# EAGLE design WorkingVersion_Final_Bread_Proofing_Box_2020_06_04_Rev_B (EAGLE 9.6.1)

## Sheet 1 of 2
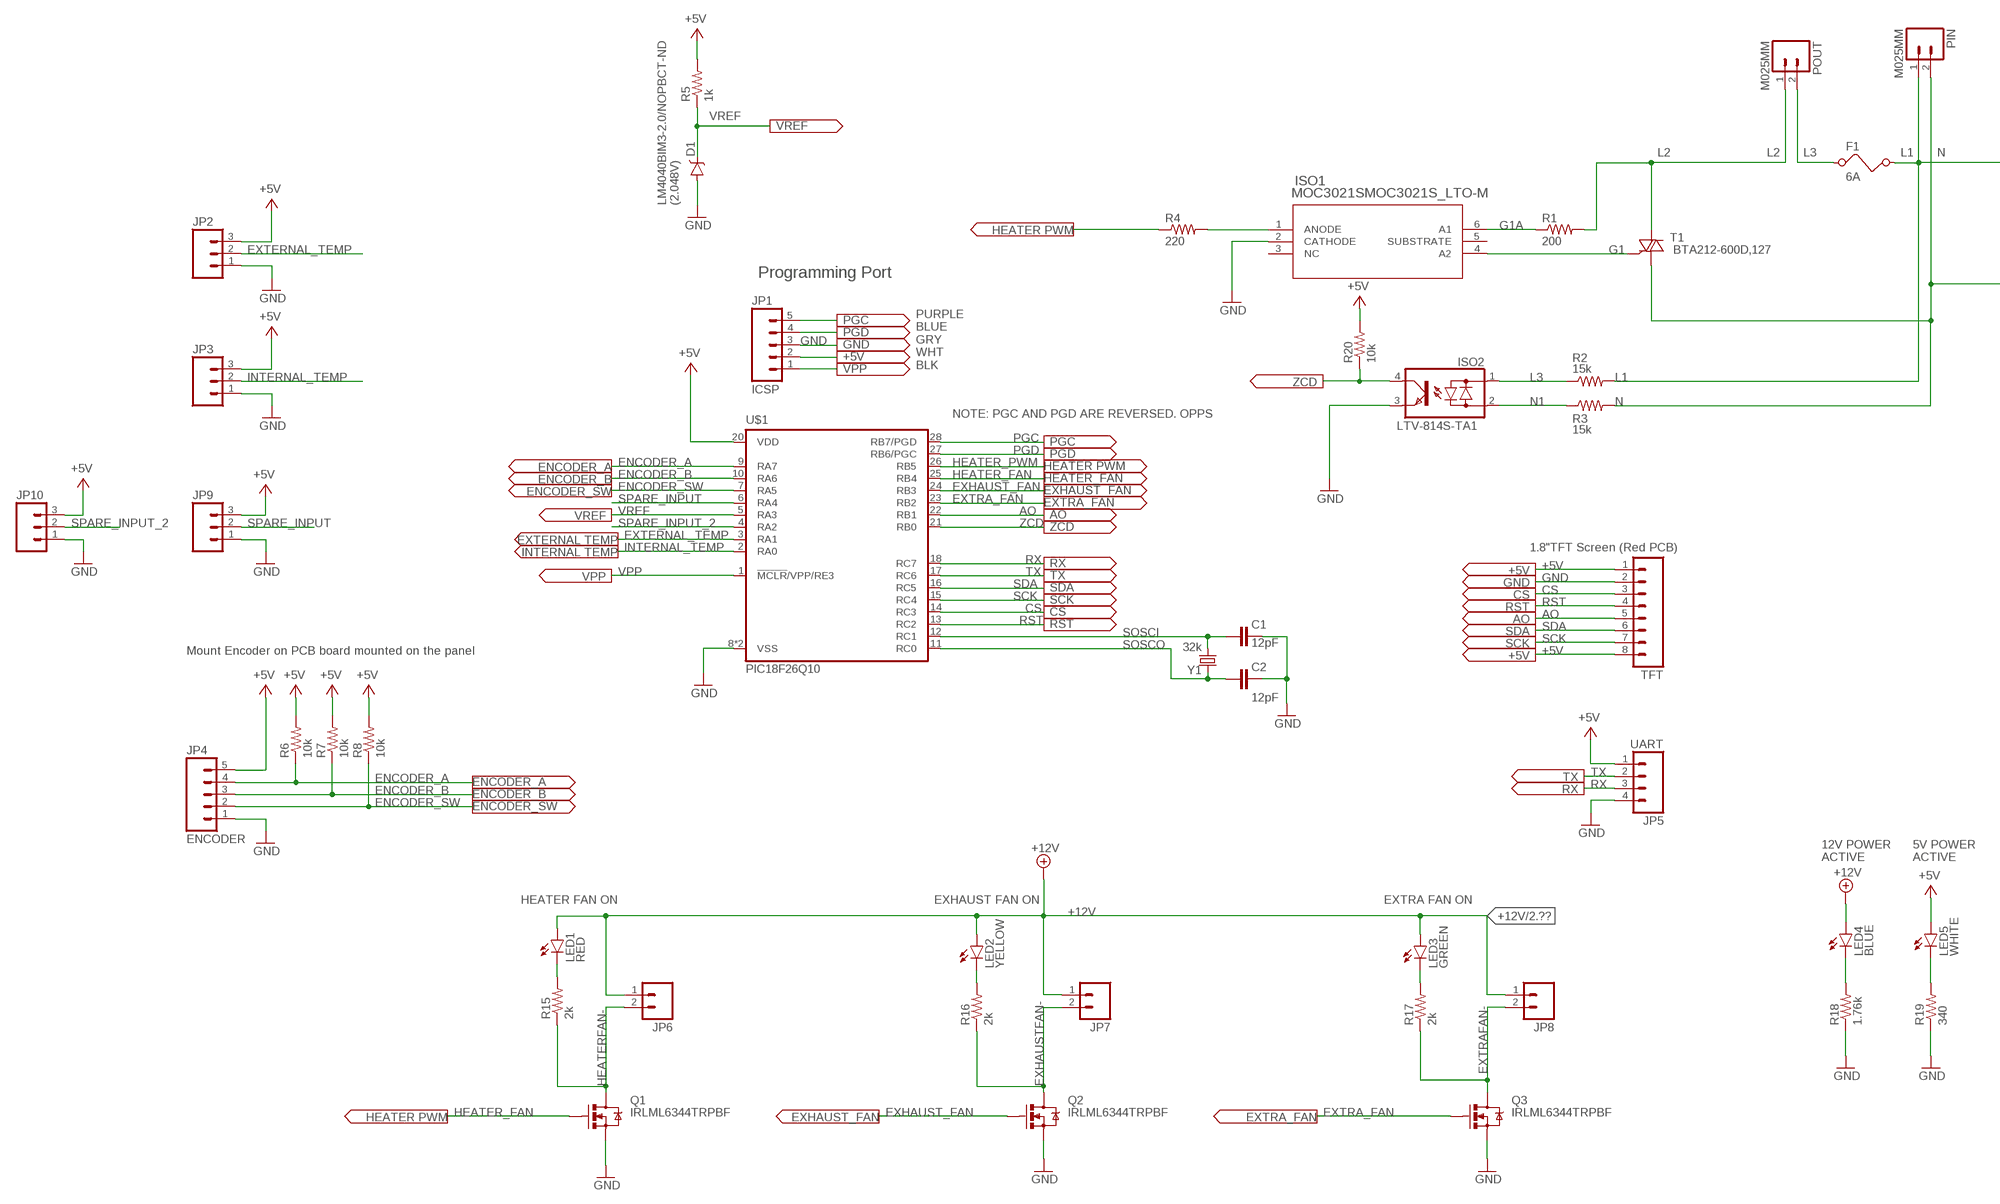
[diagram p0: schematic, sheet 1, part 1 of 2]
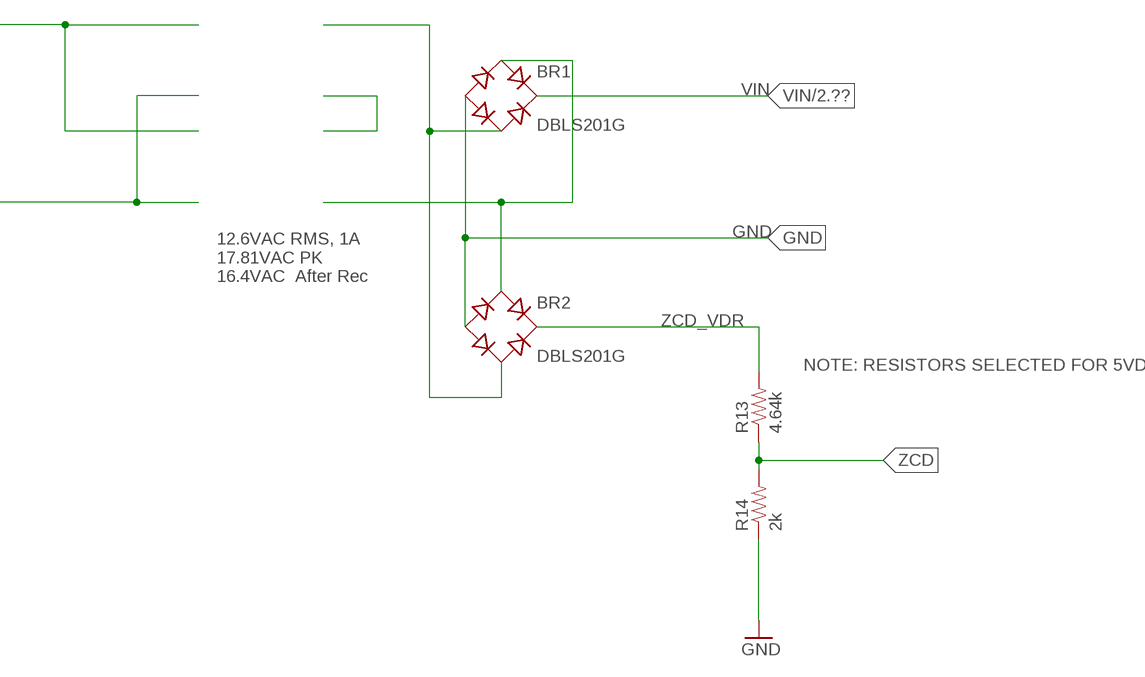
[diagram p1: schematic, sheet 1, part 2 of 2]

### Parts
BR1  DBLS201G  [DBS]
BR2  DBLS201G  [DBS]
C1  12pF  CAP0805  [0805]
C2  12pF  CAP0805  [0805]
D1  V-REFERENCESMD  [SOT23-3]
F1  6A  FUSE  [FUSE]
ISO1  MOC3021SMOC3021S_LTO-M  [MOC3021S_LTO-M]
ISO2  LTV-814S-TA1  SFH6206  [DIL4-SMD]
JP1  ICSP  M05PTH  [1X05]
JP2  M03POLAR  [MOLEX-1X3]
JP3  M03POLAR  [MOLEX-1X3]
JP4  ENCODER  M05PTH  [1X05]
JP5  UART  M04LOCK  [1X04_LOCK]
JP6  M02POLAR_LOCK  [MOLEX-1X2_LOCK]
JP7  M02POLAR_LOCK  [MOLEX-1X2_LOCK]
JP8  M02POLAR_LOCK  [MOLEX-1X2_LOCK]
JP9  M03POLAR  [MOLEX-1X3]
JP10  M03POLAR  [MOLEX-1X3]
LED1  RED  LED1206  [LED-1206]
LED2  YELLOW  LED1206  [LED-1206]
LED3  GREEN  LED1206  [LED-1206]
LED4  BLUE  LED1206  [LED-1206]
LED5  WHITE  LED1206  [LED-1206]
PIN  M025MM  [SCREWTERMINAL-5MM-2]
POUT  M025MM  [SCREWTERMINAL-5MM-2]
Q1  IRLML6344TRPBF  MOSFET-NCHANNEL2N7002PW  [SOT323]
Q2  IRLML6344TRPBF  MOSFET-NCHANNEL2N7002PW  [SOT323]
Q3  IRLML6344TRPBF  MOSFET-NCHANNEL2N7002PW  [SOT323]
R1  200  R-US_R2512  [R2512]
R2  15k  R-US_R2512  [R2512]
R3  15k  R-US_R2512  [R2512]
R4  220  RESISTOR1206  [1206]
R5  1k  RESISTOR1206  [1206]
R6  10k  RESISTOR1206  [1206]
R7  10k  RESISTOR1206  [1206]
R8  10k  RESISTOR1206  [1206]
R13  4.64k  RESISTOR1206  [1206]
R14  2k  RESISTOR1206  [1206]
R15  2k  RESISTOR1206  [1206]
R16  2k  RESISTOR1206  [1206]
R17  2k  RESISTOR1206  [1206]
R18  1.76k  RESISTOR1206  [1206]
R19  340  RESISTOR1206  [1206]
R20  10k  RESISTOR1206  [1206]
T1  BTA212-600D,127  BT138-V  [TO220BV]
TFT  M08LOCK  [1X08_LOCK]
U$1  PIC18F26Q10  PIC18F25K22SOIC  [SO28W]
Y1  32k  CRYSTALTC26V  [TC26V]

### Nets
+5V: JP1.2 JP2.3 JP3.3 JP4.5 JP5.1 JP9.3 JP10.3 LED5.A R5.2 R6.2 R7.2 R8.2 R20.2 TFT.1 TFT.8 U$1.20(VDD) ; also sheet 2
+12V: JP6.1 JP7.1 JP8.1 LED1.A LED2.A LED3.A LED4.A ; also sheet 2
AO: TFT.5 U$1.22(RB1)
CS: TFT.3 U$1.14(RC3)
ENCODER_A: JP4.4 R6.1 U$1.9(RA7)
ENCODER_B: JP4.3 R7.1 U$1.10(RA6)
ENCODER_SW: JP4.2 R8.1 U$1.7(RA5)
EXHAUST_FAN: Q2.1(G) U$1.24(RB3)
EXHAUSTFAN-: JP7.2 Q2.3(D) R16.1
EXTERNAL_TEMP: JP2.2 U$1.3(RA1)
EXTRA_FAN: Q3.1(G) U$1.23(RB2)
EXTRAFAN-: JP8.2 Q3.3(D) R17.1
G1: ISO1.4(A2) T1.G
G1A: ISO1.6(A1) R1.1
GND: BR1.- BR2.- C1.2 C2.2 D1.2(A) ISO1.2(CATHODE) ISO2.3(E) JP1.3 JP2.1 JP3.1 JP4.1 JP5.4 JP9.1 JP10.1 Q1.2(S) Q2.2(S) Q3.2(S) R14.1 R18.1 R19.1 TFT.2 U$1.8(VSS) U$1.19(VSS) ; also sheet 2
HEATER_FAN: Q1.1(G) U$1.25(RB4)
HEATER_PWM: R4.1 U$1.26(RB5)
HEATERFAN-: JP6.2 Q1.3(D) R15.1
INTERNAL_TEMP: JP3.2 U$1.2(RA0)
L1: F1.2 PIN.1 R2.2
L2: POUT.1 R1.2 T1.T2(A2)
L3: F1.1 ISO2.1(AC1) POUT.2 R2.1
N: PIN.2 R3.2 T1.T1(A1)
N1: ISO2.2(AC2) R3.1
N$1: ISO1.1(ANODE) R4.2
N$3: LED1.C R15.2
N$4: LED2.C R16.2
N$5: LED3.C R17.2
N$6: BR1.AC2 BR2.AC2
N$7: BR1.AC1 BR2.AC1
N$12: LED4.C R18.2
N$13: LED5.C R19.2
PGC: JP1.5 U$1.28(RB7/PGD)
PGD: JP1.4 U$1.27(RB6/PGC)
RST: TFT.4 U$1.13(RC2)
RX: JP5.3 U$1.18(RC7)
SCK: TFT.7 U$1.15(RC4)
SDA: TFT.6 U$1.16(RC5)
SOSCI: C1.1 U$1.12(RC1) Y1.1
SOSCO: C2.1 U$1.11(RC0) Y1.2
SPARE_INPUT: JP9.2 U$1.6(RA4)
SPARE_INPUT_2: JP10.2 U$1.4(RA2)
TX: JP5.2 U$1.17(RC6)
VIN: BR1.+ ; also sheet 2
VPP: JP1.1 U$1.1(!MCLR!/VPP/RE3)
VREF: D1.1(C) R5.1 U$1.5(RA3)
ZCD: ISO2.4(C) R13.1 R14.2 R20.1 U$1.21(RB0)
ZCD_VDR: BR2.+ R13.2
Unconnected: ISO1.3(NC) ISO1.5(SUBSTRATE)

### Notes on the sheet
- LM4040BIM3-2.0/NOPBCT-ND
  (2.048V)
- Programming Port
- 12.6VAC RMS, 1A
  17.81VAC PK
  16.4VAC  After Rec
- PURPLE
  BLUE
  GRY
  WHT
  BLK
- NOTE: RESISTORS SELECTED FOR 5VDC
- NOTE: PGC AND PGD ARE REVERSED. OPPS
- 1.8"TFT Screen (Red PCB)
- Mount Encoder on PCB board mounted on the panel
- 12V POWER
  ACTIVE
- 5V POWER
  ACTIVE
- HEATER FAN ON | EXHAUST FAN ON | EXTRA FAN ON

## Sheet 2 of 2
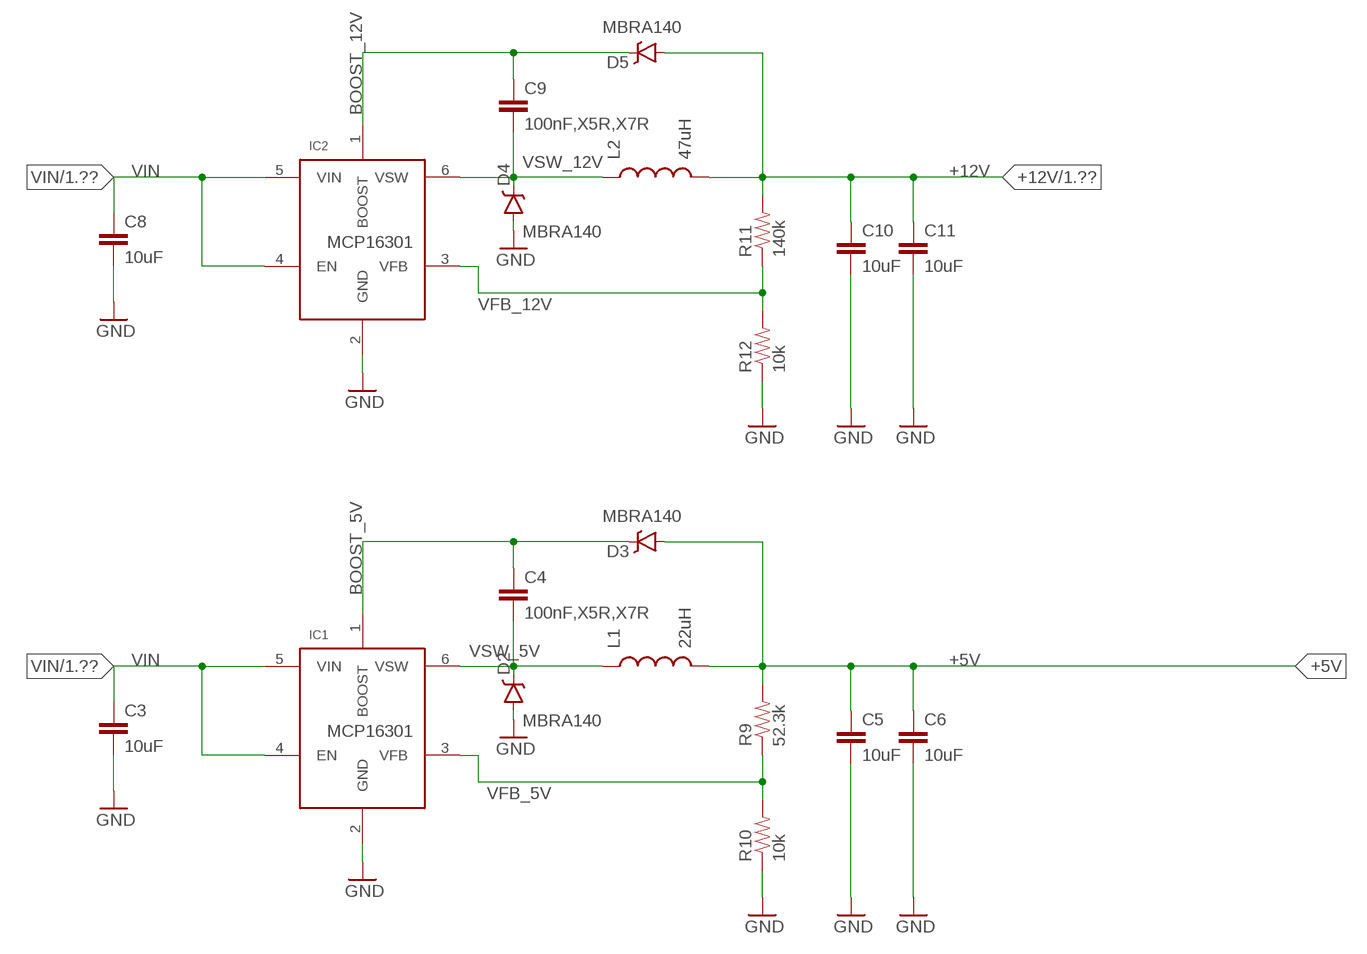
[diagram p2: schematic, sheet 2]

### Parts
C3  10uF  CAP1206  [1206]
C4  100nF,X5R,X7R  CAP1206  [1206]
C5  10uF  CAP1206  [1206]
C6  10uF  CAP1206  [1206]
C8  10uF  CAP1206  [1206]
C9  100nF,X5R,X7R  CAP1206  [1206]
C10  10uF  CAP1206  [1206]
C11  10uF  CAP1206  [1206]
D2  MBRA140  DIODE-SCHOTTKY-MBRA140  [SMA-DIODE]
D3  MBRA140  DIODE-SCHOTTKY-MBRA140  [SMA-DIODE]
D4  MBRA140  DIODE-SCHOTTKY-MBRA140  [SMA-DIODE]
D5  MBRA140  DIODE-SCHOTTKY-MBRA140  [SMA-DIODE]
IC1  MCP16301  [SOT23-6]
IC2  MCP16301  [SOT23-6]
L1  22uH  INDUCTOR1210  [1210]
L2  47uH  INDUCTOR1210  [1210]
R9  52.3k  RESISTOR1206  [1206]
R10  10k  RESISTOR1206  [1206]
R11  140k  RESISTOR1206  [1206]
R12  10k  RESISTOR1206  [1206]

### Nets
+5V: C5.1 C6.1 D3.A L1.2 R9.2 ; also sheet 1
+12V: C10.1 C11.1 D5.A L2.2 R11.2 ; also sheet 1
BOOST_5V: C4.1 D3.C IC1.1(BOOST)
BOOST_12V: C9.1 D5.C IC2.1(BOOST)
GND: C3.2 C5.2 C6.2 C8.2 C10.2 C11.2 D2.A D4.A IC1.2(GND) IC2.2(GND) R10.1 R12.1 ; also sheet 1
VFB_5V: IC1.3(VFB) R9.1 R10.2
VFB_12V: IC2.3(VFB) R11.1 R12.2
VIN: C3.1 C8.1 IC1.4(EN) IC1.5(VIN) IC2.4(EN) IC2.5(VIN) ; also sheet 1
VSW_5V: C4.2 D2.C IC1.6(VSW) L1.1
VSW_12V: C9.2 D4.C IC2.6(VSW) L2.1

### Notes on the sheet
- MCP16301
- MCP16301

## Library data of the parts
BR1 BR2 = rectifier:DB?*G: Single Phase 1.0 AMP Glass Passivated Bridge Rectifier Taiwan Semiconductor Co.,Ltd. - TSC Source: http://www.taiwansemi.com/TSCbig5/ezcatfiles/cust/img/img/db101g.pdf http://www.ts.com.tw/db/pictures/modules/PDT/PDT060207001/DBLS201G.pdf
C1-C6 C8-C11 = SparkFun-Capacitors:CAP: Capacitor Standard 0603 ceramic capacitor, and 0.1" leaded capacitor.
D1 = SparkFun-DiscreteSemi:V-REFERENCE: Zener diode
D2-D5 = SparkFun-DiscreteSemi:DIODE-SCHOTTKY: Schottky diodes in SFE's production catalog BAT20J 1A 23V 0.62Vf RB751 120mA 40V 0.37Vf PMEG4005EJ 0.5A 40V 0.42Vf MBRA140 1A 40V 0.5Vf B340A 3A 40V SMA; PROD_ID: DIO-08053
F1 = special:FUSE: FUSE 5 x 20 mm
IC1 IC2 = LM16301:MCP16301
ISO1 = MOC3021S:MOC3021S; BUILT_BY: EMA_Cory; COPYRIGHT: Copyright (C) 2018 Accelerated Designs. All rights reserved; MANUFACTURER_PART_NUMBER: MOC3021S; SOURCELIBRARY: Lite-On_2019-12-03; VENDOR: Lite-On
ISO2 = optocoupler:SFH620: Optocoupler, Phototransistor Output, AC Input Source: http://www.vishay.com/docs/83675/sfh620.pdf; MF: VISHAY/TELEFUNKEN; MPN: SFH6206-3; OC_FARNELL: 1469585; OC_NEWARK: 58K2214
JP1 JP4 = SparkFun-Connectors:M05: Header 5 Standard 5-pin 0.1" header. Use with straight break away headers (SKU : PRT-00116), right angle break away headers (PRT-00553), swiss pins (PRT-00743), machine pins (PRT-00117), and female headers (PRT-00115). Molex polarized connector foot print use with SKU : PRT-08230 with associated crimp pins and housings.
JP2 JP3 JP9 JP10 = SparkFun-Connectors:M03: Header 3 Standard 3-pin 0.1" header. Use with straight break away headers (SKU : PRT-00116), right angle break away headers (PRT-00553), swiss pins (PRT-00743), machine pins (PRT-00117), and female headers (PRT-00115). Molex polarized connector foot print use with SKU : PRT-08232 with associated crimp pins and housings.
JP5 = SparkFun-Connectors:M04: Header 4 Standard 4-pin 0.1" header. Use with straight break away headers (SKU : PRT-00116), right angle break away headers (PRT-00553), swiss pins (PRT-00743), machine pins (PRT-00117), and female headers (PRT-00115). Molex polarized connector foot print use with SKU : PRT-08231 with associated crimp pins and housings. 1MM SMD Version SKU: PRT-10208
JP6-JP8 = SparkFun-Connectors:M02: Standard 2-pin 0.1" header. Use with - straight break away headers ( PRT-00116) - right angle break away headers (PRT-00553) - swiss pins (PRT-00743) - machine pins (PRT-00117) - female headers (PRT-00115) Molex polarized connector foot print use with: PRT-08233 with associated crimp pins and housings. 2.54_SCREWTERM for use with PRT-10571. 3.5mm Screw Terminal footprints for PRT-08084 5mm Screw Terminal footprints for use with PRT-08432
L1 L2 = SparkFun-Passives:INDUCTOR: Inductors Basic Inductor/Choke - 0603 and 1206. Footprints are not proven and vary greatly between part numbers. SRN6045- 33uH, 20% 1.4A SDR0403-560KL - 56uH, 10%, 500mA RMS/740mA peak
LED1-LED5 = SparkFun-LED:LED: LEDs Standard schematic elements and footprints for 5mm, 3mm, 1206, and 0603 sized LEDs. 5mm - Spark Fun Electronics SKU : COM-00529 (and others)
PIN POUT = SparkFun-Connectors:M02: Standard 2-pin 0.1" header. Use with - straight break away headers ( PRT-00116) - right angle break away headers (PRT-00553) - swiss pins (PRT-00743) - machine pins (PRT-00117) - female headers (PRT-00115) Molex polarized connector foot print use with: PRT-08233 with associated crimp pins and housings. 2.54_SCREWTERM for use with PRT-10571. 3.5mm Screw Terminal footprints for PRT-08084 5mm Screw Terminal footprints for use with PRT-08432; STOREFRONT_ID: PRT-08432
Q1-Q3 = SparkFun-DiscreteSemi:MOSFET-NCHANNEL: Common NMOSFET Parts MFG P/N Store ID Prod ID FDD8780 TRANS-09984 SI7820DN TRANS-11055 FDS6630A IC-08089 2N7002PW TRANS-11151 FQP30N06L COM-10213 TRANS-10060 BSS123LT1G TRANS-08345 BSS138 TRANS-00830 BS170 2N7000; PROD_ID: TRANS-11151
R1-R3 = rcl:R-US_: RESISTOR, American symbol; SPICEPREFIX: R
R4-R20 = SparkFun-Resistors:RESISTOR: Resistor Basic schematic elements and footprints for 0603, 1206, and PTH resistors.
T1 = triac:BT138: TRIAC Source: http://www.semiconductors.philips.com BT138_SERIES_2.pdf
TFT = SparkFun-Connectors:M08: Header 8 Standard 8-pin 0.1" header. Use with straight break away headers (SKU : PRT-00116), right angle break away headers (PRT-00553), swiss pins (PRT-00743), machine pins (PRT-00117), and female headers (PRT-00115).
U$1 = PIC18F25K22:PIC18F25K22
Y1 = adafruit:CRYSTAL: CRYSTAL; OC_FARNELL: unknown; OC_NEWARK: unknown

## Board
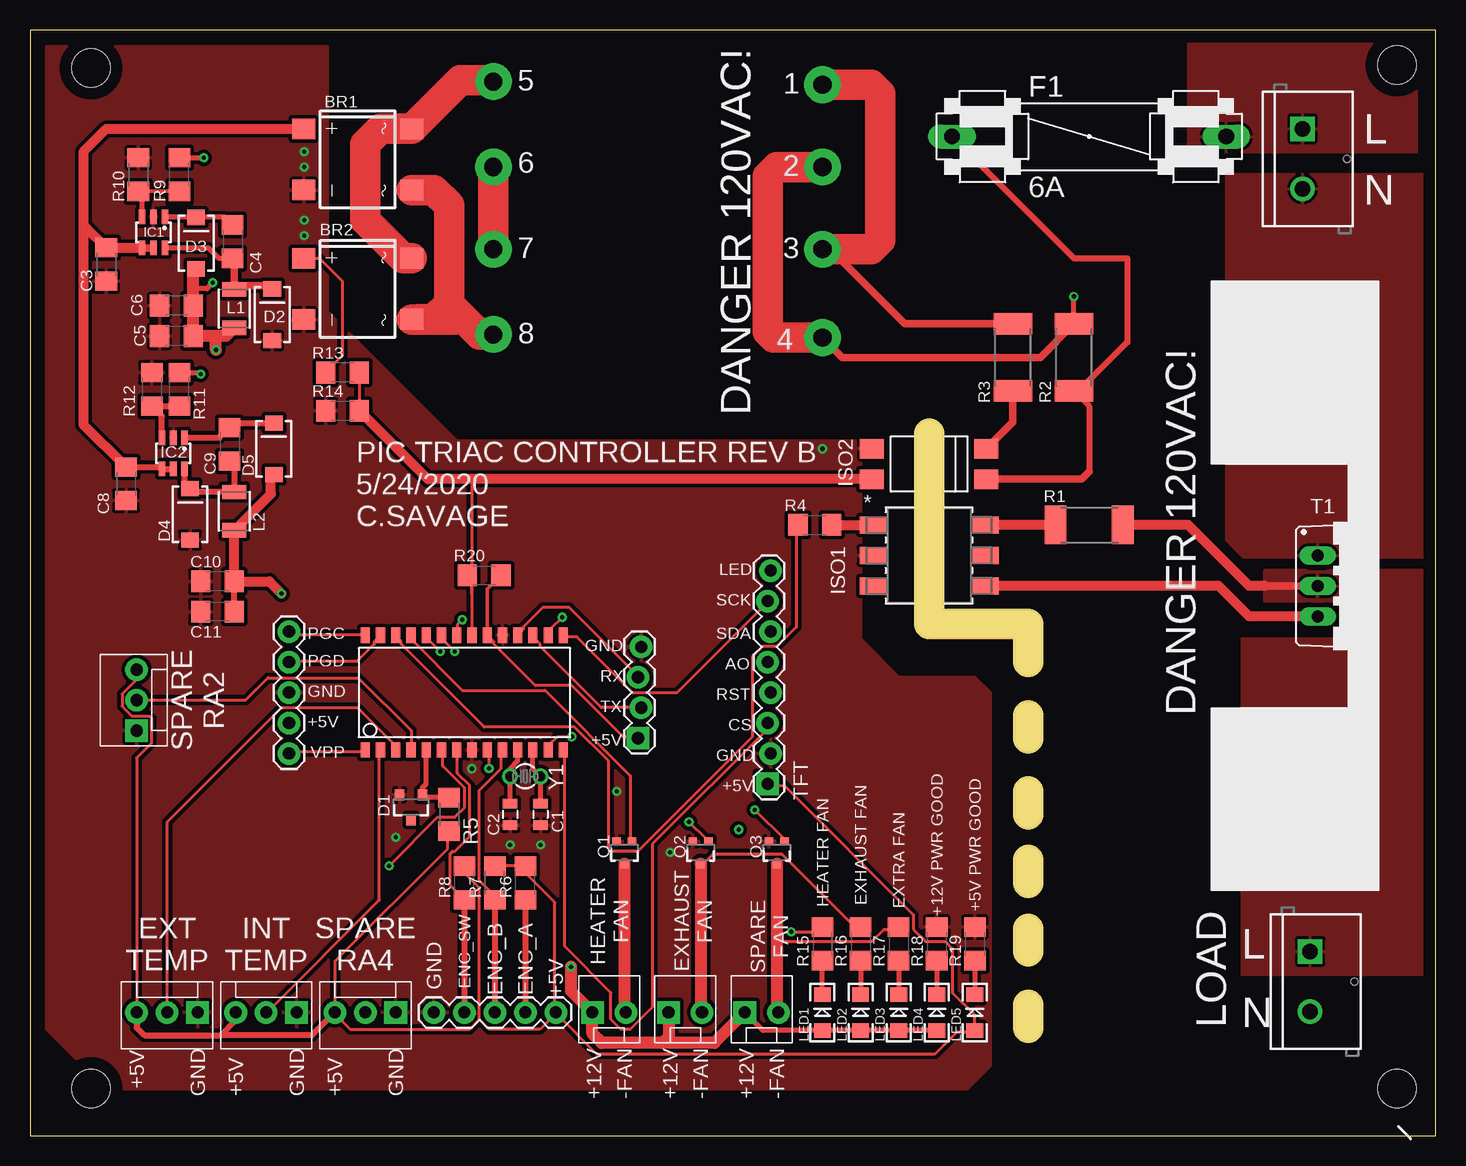
[diagram p3: board, top side]
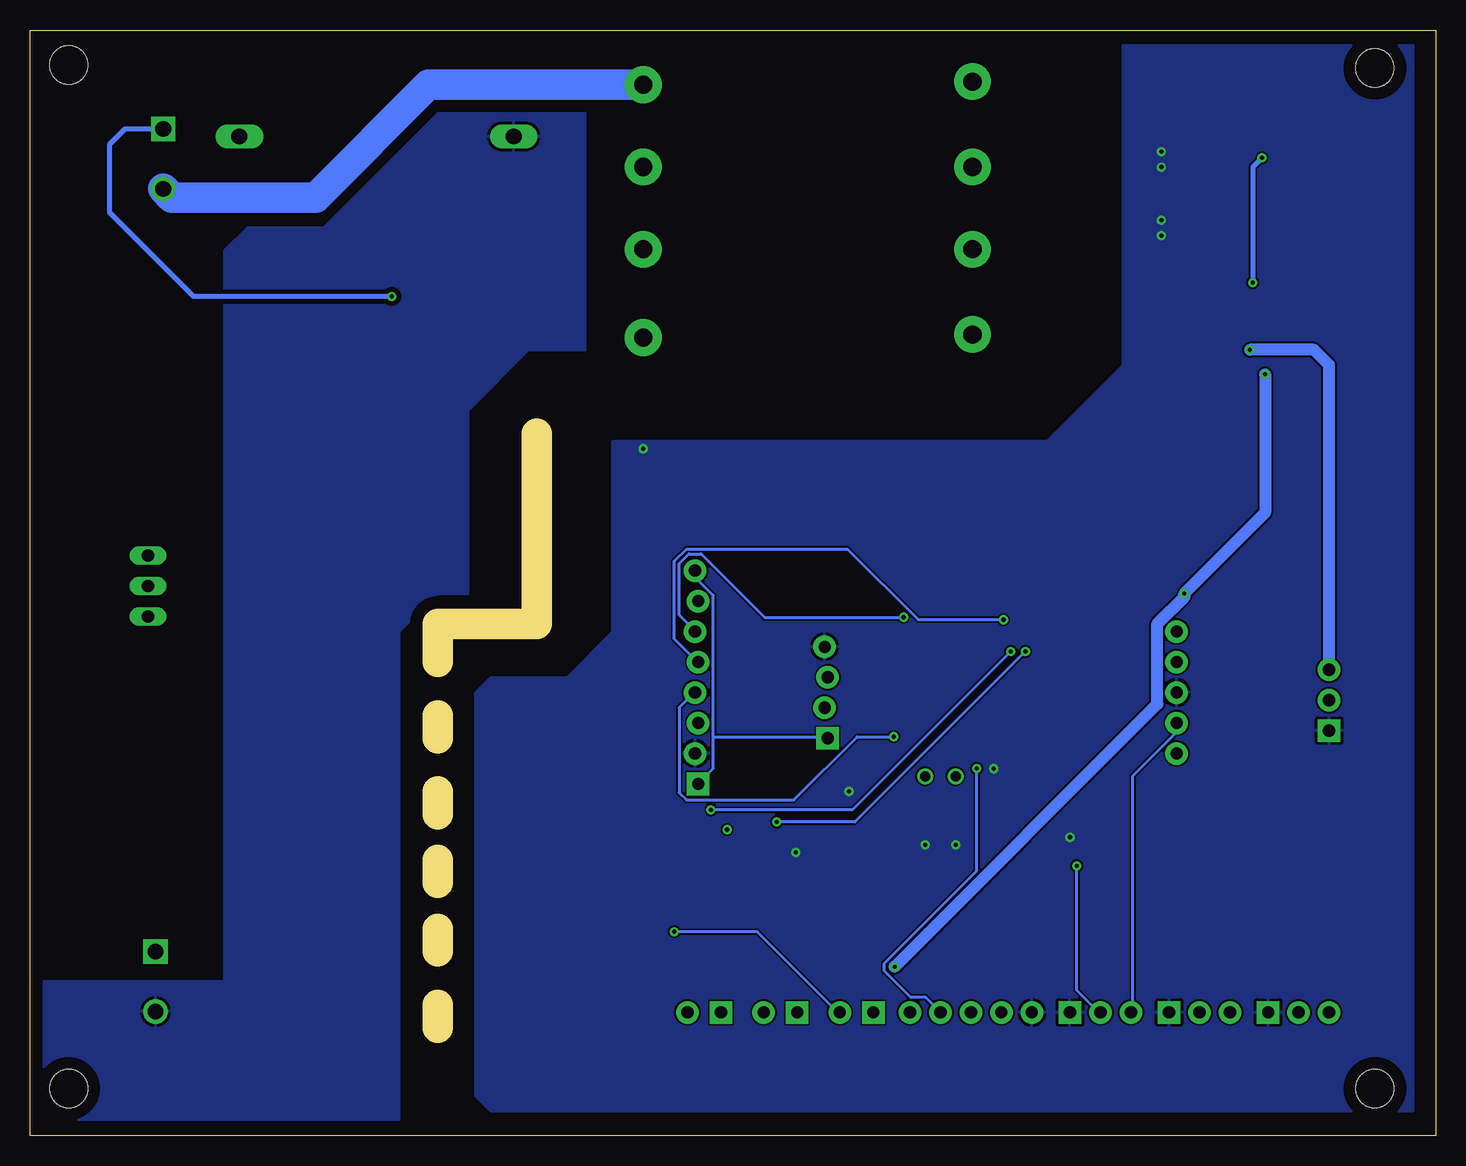
[diagram p4: board, bottom side, seen from below]

Size 117.14 x 92.19 mm. Coordinates in mm from the lower left corner, seen from the top.
Outline: 74.93,58.55 74.93,42.67 83.18,42.67 83.18,39.5
Outline: 83.18,35.05 83.18,33.15
Outline: 83.18,28.7 83.18,26.8
Outline: 83.18,22.99 83.18,21.08
Outline: 83.18,17.27 83.18,15.37
Outline: 83.18,10.92 83.18,9.02
Outline: 0,0 117.14,0 117.14,92.19 0,92.19 0,0
Copper layers (1*16): Top 0.035mm / dielectric 1.5mm / Bottom 0.035mm
Design rules "default": minimum track width 10mil, minimum drill 0.35mm, track to track 6mil, track to pad 6mil, pad to pad 6mil, via to via 6mil, smd to smd 6mil, copper to edge 40mil, drill to drill 6mil, minimum pad ring 10mil, minimum via ring 8mil, stop-mask expansion 4mil, vias tented up to drill 0mil, thermal gap 10mil
Holes 3.17 mm at 5.08,3.94 113.92,3.94 113.92,89.28 5.08,89.03
tKeepout: area 72.4,4.6 to 85.1,62.4
Milling: 10 lines

### Footprints (pad centres in the part's own frame; a part is rotated, then mirrored left to right if it is on the bottom)
DBS = smd 1.7 x 1.9: + -2.55,-4.5; - 2.55,-4.5; AC1 -2.55,4.5; AC2 2.55,4.5
0805 = smd 0.8 x 1.2: 1 -0.9,0; 2 0.9,0
1206 = smd 1.6 x 1.8: 1 -1.4,0; 2 1.4,0
SOT23-3 = smd 0.8 x 0.9: 1 -0.95,-1; 2 0.95,-1; 3 0,1.1
SMA-DIODE = smd 1.27 x 1.47: A -2.15,0; C 2.15,0
FUSE = drill 1.321 long: 1 -11.43,0; 2 11.43,0
SOT23-6 = smd 0.55 x 1.2: 1 0.95,1.3; 2 0,1.3; 3 -0.95,1.3; 4 -0.95,-1.3; 5 0,-1.3; 6 0.95,-1.3
MOC3021S_LTO-M = smd 2.261 x 1.397: 1 -4.661,2.54; 2 -4.661,0; 3 -4.661,-2.54; 4 4.661,-2.54; 5 4.661,0; 6 4.661,2.54
DIL4-SMD = smd 1.6 x 2: 1 -1.27,-4.77; 2 1.27,-4.77; 3 1.27,4.77; 4 -1.27,4.77
1X05 = drill 1.016 pad 1.88: 1 0,0; 2 2.54,0; 3 5.08,0; 4 7.62,0; 5 10.16,0
MOLEX-1X3 = drill 1.016 pad 1.88 square: 1 0,0 | drill 1.016 pad 1.88: 2 2.54,0; 3 5.08,0
1X04_LOCK = drill 1.016 pad 1.88 square: 1 0,0.127 | drill 1.016 pad 1.88: 2 2.54,-0.127; 3 5.08,0.127; 4 7.62,-0.127
MOLEX-1X2_LOCK = drill 1.016 pad 1.88 square: 1 -0.127,0 | drill 1.016 pad 1.88: 2 2.667,0
1210 = smd 1.2 x 2: 1 -1.6,0; 2 1.6,0
LED-1206 = smd 1.2 x 1.4: A -1.5,0; C 1.5,0
SCREWTERMINAL-5MM-2 = drill 1.3 pad 2.032 square: 1 0,0 | drill 1.3 pad 2.032: 2 5,0
SOT323 = smd 0.7 x 0.7: 1 -0.65,-0.925; 2 0.65,-0.925; 3 0,0.925
R2512 = smd 1.8 x 3.2: 1 -2.8,0; 2 2.8,0
TO220BV = drill 1.016 long: G 2.54,-2.54; T1 -2.54,-2.54; T2 0,-2.54
1X08_LOCK = drill 1.016 pad 1.88 square: 1 0,0.127 | drill 1.016 pad 1.88: 2 2.54,-0.127; 3 5.08,0.127; 4 7.62,-0.127; 5 10.16,0.127; 6 12.7,-0.127; 7 15.24,0.127; 8 17.78,-0.127
SO28W = smd 0.762 x 1.27: 1 -7.62,-4.78; 2 -6.35,-4.78; 3 -5.08,-4.78; 4 -3.81,-4.78; 5 -2.54,-4.78; 6 -1.27,-4.78; 7 0,-4.78; 8 1.27,-4.78; 9 2.54,-4.78; 10 3.81,-4.78; 11 5.08,-4.78; 12 6.35,-4.78; 13 7.62,-4.78; 14 8.89,-4.78; 15 8.89,4.78; 16 7.62,4.78; 17 6.35,4.78; 18 5.08,4.78; 19 3.81,4.78; 20 2.54,4.78; 21 1.27,4.78; 22 0,4.78; 23 -1.27,4.78; 24 -2.54,4.78; 25 -3.81,4.78; 26 -5.08,4.78; 27 -6.35,4.78; 28 -7.62,4.78
TC26V = drill 0.813: 1 -1.27,0; 2 1.27,0

### Placement (x,y rotation side)
BR1  27.3,81.41 270 top
BR2  27.3,70.61 270 top
C1  42.55,26.8 270 top
C2  40.01,26.8 270 top
C3  6.35,72.64 270 top
C4  16.89,74.55 270 top
C5  12.19,66.67 180 top
C6  12.19,69.22 180 top
C8  8,54.36 270 top
C9  16.64,57.66 270 top
C10  15.62,46.23 180 top
C11  15.62,43.69 180 top
D1  31.75,27.43 180 top
D2  20.19,68.45 90 top
D3  13.84,74.42 90 top
D4  13.34,51.82 90 top
D5  20.32,57.28 90 top
F1  88.27,83.31 0 top
HEATSINK  [7-345-2PP-BA]  112.39,45.85 90 top
IC1  10.29,75.31 0 top
IC2  11.94,56.9 0 top
ISO1  74.93,48.39 0 top
ISO2  74.93,56.01 90 top
JP1  21.59,31.88 90 top
JP2  13.97,10.29 180 top
JP3  22.23,10.29 180 top
JP4  33.66,10.29 0 top
JP5  50.8,33.15 90 top
JP6  46.99,10.29 0 top
JP7  53.34,10.29 0 top
JP8  59.69,10.29 0 top
JP9  30.48,10.29 180 top
JP10  8.89,33.78 90 top
L1  17.02,68.96 270 top
L2  17.02,52.07 270 top
LED1  66.04,10.29 90 top
LED2  69.22,10.29 90 top
LED3  72.39,10.29 90 top
LED4  75.56,10.29 90 top
LED5  78.74,10.29 90 top
PIN  106.04,83.95 270 top
POUT  106.68,15.37 270 top
Q1  49.53,23.62 180 top
Q2  55.88,23.62 180 top
Q3  62.23,23.62 180 top
R1  88.27,50.93 0 top
R2  86.99,64.9 90 top
R3  81.91,64.9 90 top
R4  65.41,50.93 0 top
R5  34.92,26.8 270 top
R6  41.27,21.08 90 top
R7  38.73,21.08 90 top
R8  36.2,21.08 90 top
R9  12.45,80.14 90 top
R10  9.02,80.14 270 top
R11  12.45,62.23 90 top
R12  10.16,62.23 270 top
R13  26.03,63.63 180 top
R14  26.03,60.45 0 top
R15  66.04,16 270 top
R16  69.22,16 270 top
R17  72.39,16 270 top
R18  75.56,16 270 top
R19  78.74,16 270 top
R20  37.85,46.74 0 top
T1  109.85,45.85 270 top
TFT  61.59,29.34 90 top
U$1  35.56,36.96 0 top
Y1  41.27,29.97 180 top

### Tracks (layer width: path | path; a pad name or v marks a point on that pad's centre or on a via)
+5V  (via drill 0.35)
  Top 0.254: U$1.20 38.25,41.6 38.66,41.2 38.66,41 42.11,37.54 45.16,37.54 49.43,33.27 50.65,33.27 JP5.1 | TFT.1 61.62,29.21 62.84,29.21 73.61,18.44 73.61,17.22 74.62,16.2 76.25,16.2 76.86,15.6 76.86,11.94 78.69,10.11 78.69,8.89 LED5.A 78.69,8.69 77.27,8.69 75.44,6.86 47.19,6.86 43.94,10.11 JP4.5 | R7.2 38.86,22.5 41.1,22.5 R6.2 41.3,22.3 41.3,21.89 43.74,19.46 43.74,10.31 JP4.5 | 37.44,9.7 37.44,20.68 36.22,21.89 36.22,22.3 R8.2 | 37.44,9.7 38.25,8.89 42.52,8.89 43.74,10.11 JP4.5 | R5.2 34.8,25.35 34.8,23.93 25.45,14.58 25.45,10.52 JP9.3 25.45,10.11 26.67,8.89 36.63,8.89 37.44,9.7 | JP10.3 8.89,38.05 7.67,36.83 7.67,35.82 8.49,35 9.95,35 10.11,34.84 10.11,32.73 8.89,31.51 JP2.3
  Top 0.305: U$1.20 38.1,45.59 R20.2
  Top 0.406: R9.2 v14.47,81.54 v14.48,81.53 | v15.24,71.12 14.73,70.61 13.59,70.61
  Top 0.508: JP2.3 8.89,9.02 9.52,8.38 15.88,8.38 | 15.88,8.38 17.14,9.65 JP3.3 | JP9.3 23.49,8.38 15.88,8.38
  Top 1.016: D3.A 13.59,72.02 13.59,70.61 C6.1 C5.1 15.49,66.67 | L1.2 16.33,66.67 15.49,66.67 | v15.49,65.53 15.49,66.67
  Bottom 0.254: 60.2,33.27 60.2,30.63 61.42,29.41 TFT.1 | 60.2,33.27 60.2,45.06 61.62,46.48 61.62,47.09 TFT.8 | 60.2,33.27 50.85,33.27 JP5.1 | JP9.3 25.25,10.31 25.25,30.02 21.59,33.68 JP1.2 21.59,34.49
  Bottom 0.406: v14.48,81.53 15.24,80.77 v15.24,71.12
  Bottom 1.016: JP10.3 8.89,64.26 10.16,65.53 v15.49,65.53
+12V  (via drill 0.35)
  Top 0.406: LED4.A LED3.A LED2.A LED1.A 61.06,8.79 JP8.1 | R11.2 14.09,63.63 v14.22,63.5
  Top 0.508: 20.07,54.86 20.32,55.12 D5.A | C11.1 C10.1
  Top 0.813: v20.95,45.21 19.94,46.23 C10.1 L2.2 20.07,53.52 20.07,54.86
  Top 1.016: JP8.1 57.02,7.75 52.7,7.75 | 52.7,7.75 47.62,7.75 46.86,8.51 JP6.1 45.09,12.06 v45.09,14.1 | JP7.1 53.21,8.25 52.7,7.75
  Bottom 0.406: v14.22,63.5 14.3,63.42
  Bottom 1.016: v45.09,14.1 23.19,35.99 23.19,42.7 20.95,44.94 v20.95,45.21 14.22,51.94 v14.22,63.5
AO  (via drill 0.35)
  Top 0.254: v36.02,43.03 35.61,42.62 35.61,41.81 U$1.22
  Bottom 0.254: v36.02,43.03 43.13,43.03 49.02,48.92 62.43,48.92 63.45,47.9 63.45,41.4 61.62,39.57 TFT.5
BOOST_5V
  Top 0.406: C4.1 16.27,76.57 D3.C 11.28,76.57 IC1.1
BOOST_12V
  Top 0.508: D5.C 17.01,59.43 C9.1 15.78,58.2 IC2.1
CS
  Top 0.254: U$1.14 44.55,32.05 44.55,15.8 48.41,11.94 48.41,9.7 49.23,8.89 50.04,8.89 51.87,10.72 51.87,24.33 61.42,33.88 61.42,34.29 TFT.3
ENCODER_A  (via drill 0.35)
  Top 0.254: v38.25,30.63 38.25,32.05 U$1.9
  Top 0.508: R6.1 JP4.4
  Bottom 0.254: v38.25,30.63 38.25,22.1 45.97,14.38 45.97,13.77 43.74,11.53 42.52,11.53 JP4.4
ENCODER_B
  Top 0.254: U$1.10 39.27,32.05 39.27,30.63 37.44,28.8 37.44,21.29 38.86,19.86 R7.1
  Top 0.508: R7.1 JP4.3
ENCODER_SW
  Top 0.254: U$1.7 35.61,32.05 35.61,30.23 36.63,29.21 36.63,24.94 35.41,23.72 35.2,23.72 35,23.52 35,20.88 36.02,19.86 R8.1
  Top 0.508: R8.1 JP4.2
EXHAUST_FAN  (via drill 0.35)
  Top 0.254: v54.91,26.16 56.34,24.74 Q2.1 | v34.19,40.39 32.97,41.6 U$1.24
  Bottom 0.254: v54.91,26.16 48.41,26.16 v34.19,40.39
EXHAUSTFAN-
  Top 0.254: R16.1 69.14,17.42 68.73,17.42 62.64,23.52 56.95,23.52 56.34,22.91 Q2.3
  Top 1.016: Q2.3 55.88,10.41 JP7.2
EXTERNAL_TEMP
  Top 0.254: JP2.2 11.43,26.16 20.98,35.71 27.28,35.71 30.33,32.66 30.33,32.26 U$1.3
EXTRA_FAN  (via drill 0.35)
  Top 0.254: v60.4,27.18 62.84,24.74 Q3.1 | v35.41,40.39 34.19,41.6 U$1.23
  Bottom 0.254: v60.4,27.18 48.62,27.18 v35.41,40.39
EXTRAFAN-
  Top 0.254: 62.23,16.2 70.16,16.2 71.17,17.22 72.39,17.22 R17.1
  Top 1.016: Q3.3 62.23,16.2 62.23,10.41 JP8.2
G1
  Top 0.61: 80.01,45.85 ISO1.4
  Top 0.813: T1.G 101.6,43.31 99.06,45.85 80.01,45.85
G1A
  Top 0.61: 80.01,50.93 ISO1.6
  Top 0.813: R1.1 80.01,50.93
GND  (via drill 0.35)
  other vias: 40.01,24.26 42.55,24.26 36.83,30.61 30.48,24.89 22.86,82.04 22.86,80.77 22.86,76.33 22.86,75.06 48.9,28.7 53.34,23.62 66.04,57.28
  pour Top (isolate 0.305, rank 2): 1.4,90.8 1.4,8.89 6.35,3.94 78.1,3.94 80.01,5.84 80.01,36.96 78.74,38.23 72.39,38.23 69.22,41.4 69.22,57.91 35.56,57.91 24.77,68.71 24.77,90.8
  pour Bottom: 6.35,2.03 75.56,2.03 78.74,2.03 80.01,3.3 80.01,36.96 78.74,38.23 72.39,38.23 68.58,42.04 68.58,57.91 32.38,57.91 31.75,58.55 26.03,64.26 26.03,90.93 1.9,90.93 1.9,2.03
HEATER_FAN
  Top 0.254: U$1.25 31.75,41.4 36.02,37.13 42.93,37.13 50.04,30.02 50.04,24.74 Q1.1
HEATER_PWM
  Top 0.254: U$1.26 30.53,41.6 30.94,41.2 30.94,41 37.85,34.09 45.36,34.09 48.21,31.24 48.21,23.93 48.41,23.72 50.65,23.72 60.2,33.27 60.2,39.98 61.01,40.79 62.23,40.79 63.86,42.42 63.86,50.75 R4.1
HEATERFAN-  (via drill 0.35)
  Top 0.254: v63.45,17.02 65.48,17.02 R15.1
  Top 1.016: Q1.3 49.53,10.41 JP6.2
  Bottom 0.254: v63.45,17.02 56.54,17.02 49.84,10.31 JP6.2
INTERNAL_TEMP
  Top 0.254: U$1.2 29.11,32.05 29.11,19.66 19.76,10.31 JP3.2
L1  (via drill 0.35, 1.52 pad 3.05)
  Top 0.406: R2.2 v86.99,69.98
  Top 0.61: R2.2 84.19,64.9 67.69,64.9 v66.04,66.55
  Top 2.54: v66.04,80.77 62.23,80.77 61.47,80.01 61.47,67.06 61.98,66.55 v66.04,66.55
  Bottom 0.406: v86.99,69.98 103.5,69.98 110.49,76.96 110.49,82.68 109.22,83.95 PIN.1
  pour Top (isolate 0.406): 96.52,82.04 115.57,82.04 115.57,91.57 96.52,91.57
L2
  Top 0.61: T1.T2 102.87,45.85
  Top 0.813: 102.87,45.85 101.6,45.85 96.52,50.93 R1.2
  pour Top (isolate 0.406): 116.2,47.12 102.87,47.12 102.87,44.58 109.85,44.58 109.85,41.4 100.96,41.4 100.96,13.46 116.2,13.46
L3
  Top 0.508: F1.1 86.99,73.15 91.44,73.15 91.44,66.17 86.99,61.72 | R2.1 88.27,60.83 88.27,55.37
  Top 0.61: 86.99,61.72 R2.1 | 88.27,55.37 87.63,54.74 ISO2.1
  pour Bottom (isolate 0.406): 100.96,12.83 117.47,12.83 117.47,1.4 86.36,1.4 86.36,42.04 83.18,45.21 80.64,45.21 80.64,60.45 75.56,65.53 70.87,65.53 70.87,85.22 83.18,85.22 92.71,75.69 99.06,75.69 100.96,73.79
N  (via drill 1.52 pad 3.05)
  Top 0.61: R3.2 72.9,67.7 66.68,73.91 v66.04,73.91
  Top 2.54: v66.04,87.63 70.1,87.63 70.87,86.87 70.87,74.68 70.1,73.91 v66.04,73.91
  Bottom 2.54: PIN.2 105.33,78.23 93.34,78.23 83.95,87.63 v66.04,87.63
  pour Top (isolate 0.813): 99.69,48.26 116.84,48.26 116.84,80.14 99.69,80.14
N1
  Top 0.61: ISO2.2 81.91,59.49 R3.1
N$1
  Top 0.406: R4.2 ISO1.1 70.48,50.93
  Top 0.813: R4.2 70.48,50.93
N$3
  Top 0.406: LED1.C R15.2
N$4
  Top 0.406: R16.2 LED2.C
N$5
  Top 0.406: R17.2 LED3.C
N$6  (via drill 1.52 pad 3.05)
  Top 0.254: BR2.AC2 31.75,68.02 32.38,68.07
  Top 2.54: BR1.AC2 33.66,78.86 34.92,77.6 34.92,69.34 | 32.38,68.07 33.66,68.07 34.92,69.34 | 35.44,68.06 BR2.AC2 | v38.61,66.8 37.46,66.8 34.92,69.34
N$7  (via drill 1.52 pad 3.05)
  Top 0.305: v38.61,87.88 38.62,87.89 38.62,88.02
  Top 2.54: BR2.AC1 31.1,73.16 27.94,76.33 27.94,82.68 29.22,83.96 BR1.AC1 35.87,88.02 38.62,88.02
N$12
  Top 0.406: R18.2 LED4.C
N$13
  Top 0.406: R19.2 LED5.C
N$17  (via drill 1.52 pad 3.05)
  Top 2.54: 38.61,76.86 v38.61,80.77 v38.61,73.91
N$18  (via drill 0.35)
  other vias: 59.05,25.53
PGC
  Top 0.254: U$1.28 27.89,41.81 21.79,41.81 21.59,42.01 JP1.5
PGD
  Top 0.254: U$1.27 29.11,41.6 28.7,41.2 28.7,41 27.28,39.57 21.59,39.57 JP1.4
RST  (via drill 0.35)
  Top 0.254: v45.16,33.27 43.94,33.27 43.33,32.66 43.33,32.26 U$1.13
  Bottom 0.254: v45.16,33.27 48.21,33.27 53.49,27.99 62.43,27.99 63.04,28.6 63.04,35.71 61.82,36.93 TFT.4
RX
  Top 0.254: U$1.18 40.69,41.81 41.1,42.21 41.1,42.42 42.72,44.04 44.96,44.04 50.65,38.35 JP5.3
SCK
  Top 0.254: U$1.15 44.55,41.6 45.57,41.6 50.24,36.93 53.9,36.93 61.42,44.45 TFT.7
SDA  (via drill 0.35)
  Top 0.254: v44.35,43.23 43.33,42.21 43.33,41.81 U$1.16
  Bottom 0.254: v44.35,43.23 55.93,43.23 61.21,48.51 62.23,48.51 63.04,47.7 63.04,43.43 61.82,42.21 TFT.6
SOSCI
  Top 0.406: U$1.12 41.91,30.61 Y1.1 C1.1
SOSCO
  Top 0.406: U$1.11 40.64,31.24 40.01,30.61 Y1.2 C2.1
SPARE_INPUT  (via drill 0.35)
  Top 0.254: v29.92,22.5 33.98,26.57 35.41,26.57 36.22,27.38 36.22,29.01 34.39,30.84 34.39,32.05 U$1.6
  Bottom 0.254: v29.92,22.5 29.92,12.14 28.09,10.31 JP9.2
SPARE_INPUT_2
  Top 0.254: JP10.2 17.96,36.32 19.81,38.18 27.36,38.18 31.75,33.78 U$1.4
TX
  Top 0.254: U$1.17 41.91,41.6 42.52,41 42.52,40.79 47.6,35.71 50.85,35.71 JP5.2
VFB_5V
  Top 0.305: R10.2 R9.1
  Top 0.406: IC1.3 9.34,78.42 R10.2
VFB_12V
  Top 0.508: IC2.3 10.99,60 R12.2 R11.1
VIN
  Top 0.508: C8.1 10.83,55.76 IC2.4 IC2.5
  Top 0.61: IC1.5 IC1.4
  Top 0.813: BR1.+ 6.36,83.96 4.44,82.04 4.44,75.69 | C8.1 4.44,59.31 4.44,75.69 | 4.44,75.69 4.7,75.69 C3.1 9.3,74.04 IC1.4
VPP
  Top 0.254: U$1.1 27.89,32.05 21.59,32.05 JP1.1
VREF
  Top 0.406: U$1.5 33.02,29.34 32.7,29.02 D1.1 32.94,28.2 R5.1
VSW_5V
  Top 0.406: C4.2 15.75,73.15 14.89,74.01 IC1.6
  Top 0.61: L1.1 17.02,70.87 | 17.02,70.87 17.02,73.02 C4.2 | D2.C 19.93,70.87 17.02,70.87
VSW_12V
  Top 0.254: 13.34,53.72 D4.C
  Top 0.508: C9.2 17.02,55.88 L2.1 13.63,53.67 D4.C 12.89,54.41 IC2.6
ZCD
  Top 0.254: R13.1 R14.2 | 36.83,54.74 36.83,46.74 36.83,45.21 U$1.21
  Top 0.305: 36.83,46.35 36.83,45.21 | R20.1 36.83,46.74
  Top 0.813: ISO2.4 36.83,54.74 33.15,54.74 R14.2
ZCD_VDR
  Top 0.254: BR2.+ 24.12,73.16 26.03,71.25 26.03,65.03 R13.2

### Text on the board
tNames: 5 | 1 | L | 6 | 2 | N | 7 | 3 | 8 | 4 | DANGER 120VAC! | PIC TRIAC CONTROLLER REV B / 5/24/2020 / C.SAVAGE | LED | SCK | PGC | SDA | GND | PGD | AO | RX | GND | SPARE / RA2 | RST | TX | DANGER 120VAC! | +5V | CS | +5V | VPP | GND | +5V | HEATER FAN | EXHAUST FAN | +12V PWR GOOD | +5V PWR GOOD | EXTRA FAN | HEATER / FAN | EXHAUST / FAN | SPARE / FAN | EXT / TEMP | INT / TEMP | SPARE / RA4 | ENC_SW | ENC_B | ENC_A | L | GND | +5V | LOAD | N | +12V | -FAN | +12V | -FAN | +12V | -FAN | +5V | GND | +5V | GND | +5V | GND
tValues: LINE